# EAGLE schematic Schematic v12 (EAGLE 9.7.0)
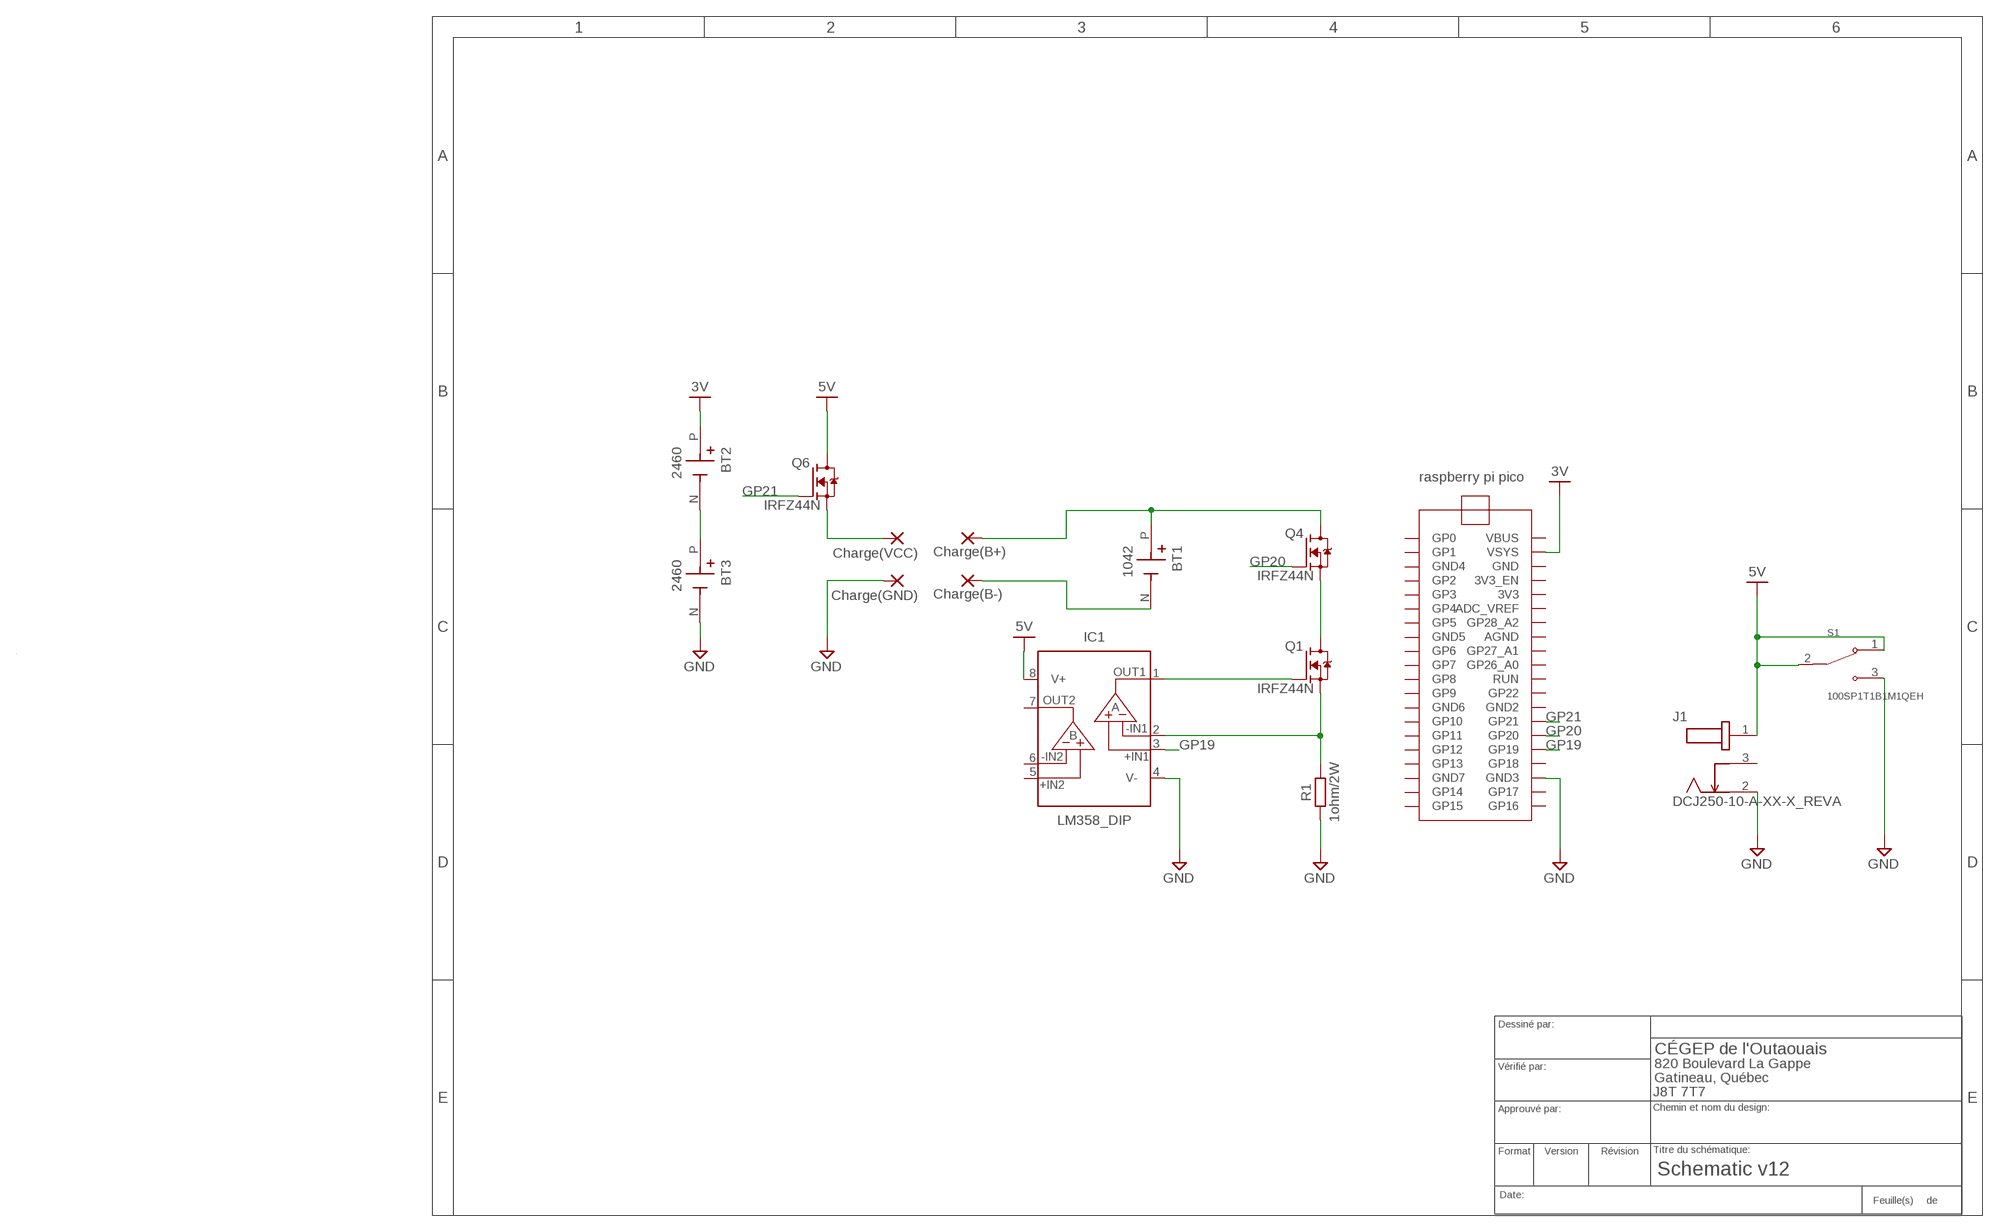
[diagram p0: schematic, sheet 1]

## Parts
BT1  1042  [BAT_1042]
BT2  2460  [BAT_2460]
BT3  2460  [BAT_2460]
IC1  LM358_DIP  [DIP826W53P254L959H508Q8B]
J1  DCJ250-10-A-XX-X_REVA  [GCT_DCJ250-10-A-XX-X_REVA]
PAD1  Charge(VCC)  SMD2  [SMD1,27-2,54]
PAD2  Charge(GND)  SMD2  [SMD1,27-2,54]
PAD3  Charge(B+)  SMD2  [SMD1,27-2,54]
PAD4  Charge(B-)  SMD2  [SMD1,27-2,54]
Q1  IRFZ44N  IRF540NPBF  [TO254P1054X469X1930-3]
Q4  IRFZ44N  IRF540NPBF  [TO254P1054X469X1930-3]
Q6  IRFZ44N  IRF540NPBF  [TO254P1054X469X1930-3]
R1  1ohm/2W  R_AXIAL-7.2MM-PITCH  [RESAD724W46L381D178B]
S1  100SP1T1B1M1QEH  [SW_100SP1T1B1M1QEH]
U1  RASPBERRY_PI_PICO  [RASPBERRY_PI_PICO]

## Nets
3V: BT2.P(POS) U1.VSYS
5V: IC1.8(V+) J1.1(CENTER) Q6.2(D) S1.1 S1.2
GND: BT3.N(NEG) IC1.4(V-) J1.2(TIP) PAD2.1(P) R1.1 S1.3 U1.GND3
GP19: IC1.3(+IN1) U1.GP19
GP20: Q4.1(G) U1.GP20
GP21: Q6.1(G) U1.GP21
N$2: Q1.2(D) Q4.3(S)
N$3: PAD1.1(P) Q6.3(S)
N$4: BT1.N(NEG) PAD4.1(P)
N$5: BT1.P(POS) PAD3.1(P) Q4.2(D)
N$6: IC1.1(OUT1) Q1.1(G)
N$7: IC1.2(-IN1) Q1.3(S) R1.2
N$8: BT2.N(NEG) BT3.P(POS)
Unconnected: IC1.5(+IN2) IC1.6(-IN2) IC1.7(OUT2) J1.3(SHUNT) U1.3V3 U1.3V3_EN U1.ADC_VREF U1.AGND U1.GND U1.GND2 U1.GND4 U1.GND5 U1.GND6 U1.GND7 U1.GP0 U1.GP1 U1.GP2 U1.GP3 U1.GP4 U1.GP5 U1.GP6 U1.GP7 U1.GP8 U1.GP9 U1.GP10 U1.GP11 U1.GP12 U1.GP13 U1.GP14 U1.GP15 U1.GP16 U1.GP17 U1.GP18 U1.GP22 U1.GP26_A0 U1.GP27_A1 U1.GP28_A2 U1.RUN U1.VBUS

## Library data of the parts
BT1 = 1042:1042; MANUFACTURER: Keystone; MAXIMUM_PACKAGE_HEIGHT: 15.11mm; PARTREV: E; SNAPEDA_PN: 1042; STANDARD: Manufacturer Recommendations
BT2 BT3 = 2460:2460; MANUFACTURER: Keystone; MAXIMUM_PACKAGE_HEIGHT: 14.14mm; PARTREV: B; SNAPEDA_PN: 2460; STANDARD: Manufacturer Recommendations
IC1 = IC_Linear:LM358: Dual Operational Amplifier Reference Datasheet <https://www.ti.com/lit/ds/symlink/lm158-n.pdf>; CATEGORY: Amplifier; DESCRIPTION: Dual Operational Amplifier; MANUFACTURER: Generic; MPN: Generic; SERIES: LM358; SUB-CATEGORY: OpAmp; TYPE: Dual
J1 = DCJ250-10-A-XX-X_REVA:DCJ250-10-A-XX-X_REVA; MANUFACTURER: Global Connector Technology; MAXIMUM_PACKAGE_HEIGHT: 11 mm; PARTREV: A; SNAPEDA_PN: DCJ250-10-A-K1-K; STANDARD: Manufacturer Recommendations
PAD1-PAD4 = wirepad:SMD2: SMD PAD
Q1 Q4 Q6 = IRF540NPBF:IRF540NPBF; MANUFACTURER: Infineon; MAXIMUM_PACKAGE_HEIGHT: 19.3 mm; PARTREV: 11/3/03; SNAPEDA_PN: IRF540NPBF; STANDARD: IPC 7351B
R1 = Resistor:R: Resistor Fixed - Generic; CATEGORY: Resistor; SUB-CATEGORY: Fixed
S1 = 100SP1T1B1M1QEH:100SP1T1B1M1QEH: Toggle Switch SPDT Panel Mount; MANUFACTURER: E-switch; MAXIMUM_PACKAGE_HEIGHT: 30.21 mm; PARTREV: D; STANDARD: IPC 7351B
U1 = RASPBERRY_PI_PICO:RASPBERRY_PI_PICO: Check availability <https://pricing.snapeda.com/parts/RASPBERRY%20PI%20PICO/Raspberry%20Pi/view-part?ref=eda>; AVAILABILITY: In Stock; CHECK_PRICES: https://www.snapeda.com/parts/RASPBERRY%20PI%20PICO/Raspberry+Pi/view-part/?ref=eda; DESCRIPTION: Raspberry Pi Board, Arm Cortex-M0+; Core Architecture:Arm; Core Sub-Architecture:Cortex-M0+; Kit Contents:Raspberry Pi Pico Board; No. Of Bits:32Bit; Silicon Core Number:Rp2040; Silicon Manufacturer:Raspberry Pi |Raspberry-Pi RASPBERRY PI PICO; MF: Raspberry Pi; MP: RASPBERRY PI PICO; PACKAGE: None; PRICE: None; SNAPEDA_LINK: https://www.snapeda.com/parts/RASPBERRY%20PI%20PICO/Raspberry+Pi/view-part/?ref=snap